# Altium schematic sheet Connectors.SchDoc: =DocumentName
size A4; Organization: Queen's Formula SAE; Address1: 130 Stuart St, Kingston; Address2: Ontario; Address3: Canada; Address4: K7L 2V9; DocumentNumber: 1; Revision: 0; SheetNumber: 1; SheetTotal: 1
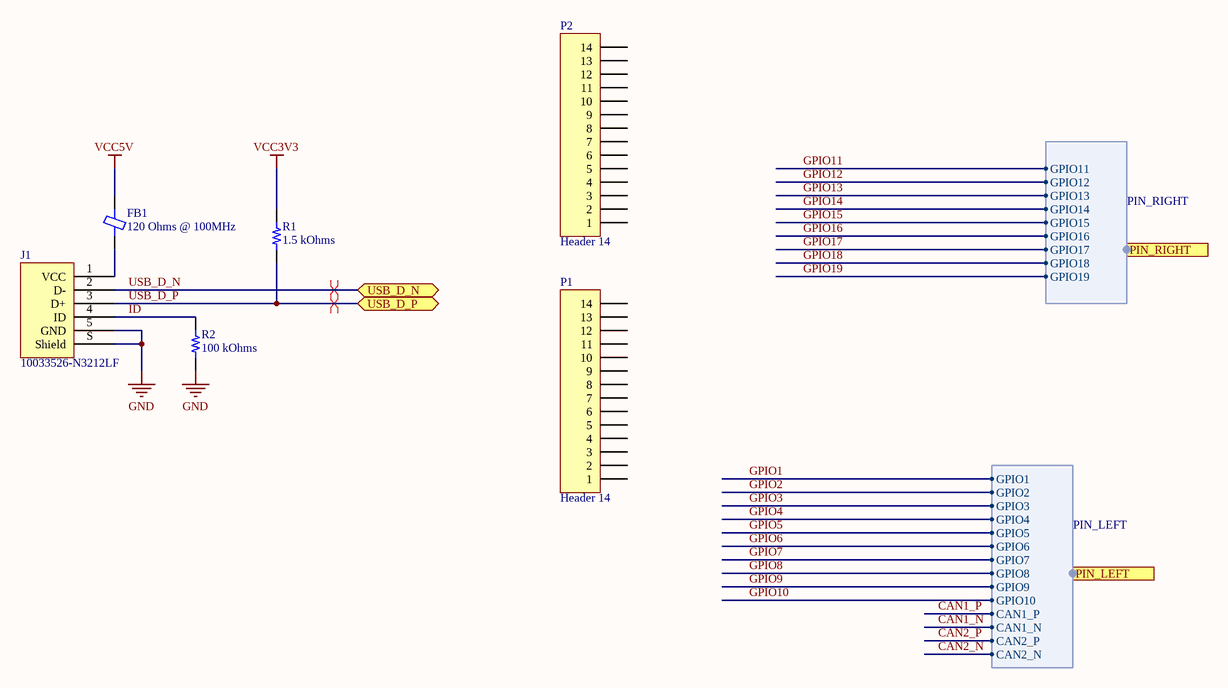
[diagram p0: Connectors.SchDoc]

## Parts
FB1  120 Ohms @ 100MHz  [FER 0805_2012]
J1  10033526-N3212LF  [FCI USB 10033526-N3212LF]
P1  Header 14  [HDR1X14]
P2  Header 14  [HDR1X14]
R1  1.5 kOhms  [RES 0402_1005]
R2  100 kOhms  [RES 0402_1005]

## Ports
PIN_LEFT (harness PIN_LEFT), PIN_RIGHT (harness PIN_RIGHT), USB_D_N (bidir), USB_D_P (bidir)

## Harnesses
PIN_LEFT: GPIO1, GPIO2, GPIO3, GPIO4, GPIO5, GPIO6, GPIO7, GPIO8, GPIO9, GPIO10, CAN1_P, CAN1_N, CAN2_P, CAN2_N
PIN_RIGHT: GPIO15, GPIO16, GPIO17, GPIO11, GPIO12, GPIO13, GPIO14, GPIO18, GPIO19

## Nets
GND: J1.5(GND) J1.S(Shield) R2.1
VCC3V3: R1.2
VCC5V: FB1.2
CAN1_N: port PIN_LEFT.CAN1_N
CAN1_P: port PIN_LEFT.CAN1_P
CAN2_N: port PIN_LEFT.CAN2_N
CAN2_P: port PIN_LEFT.CAN2_P
GPIO1: port PIN_LEFT.GPIO1
GPIO2: port PIN_LEFT.GPIO2
GPIO3: port PIN_LEFT.GPIO3
GPIO4: port PIN_LEFT.GPIO4
GPIO5: port PIN_LEFT.GPIO5
GPIO6: port PIN_LEFT.GPIO6
GPIO7: port PIN_LEFT.GPIO7
GPIO8: port PIN_LEFT.GPIO8
GPIO9: port PIN_LEFT.GPIO9
GPIO10: port PIN_LEFT.GPIO10
GPIO11: port PIN_RIGHT.GPIO11
GPIO12: port PIN_RIGHT.GPIO12
GPIO13: port PIN_RIGHT.GPIO13
GPIO14: port PIN_RIGHT.GPIO14
GPIO15: port PIN_RIGHT.GPIO15
GPIO16: port PIN_RIGHT.GPIO16
GPIO17: port PIN_RIGHT.GPIO17
GPIO18: port PIN_RIGHT.GPIO18
GPIO19: port PIN_RIGHT.GPIO19
ID: J1.4(ID) R2.2
USB_D_N: J1.2(D-) ; port USB_D_N
USB_D_P: J1.3(D+) R1.1 ; port USB_D_P
NetFB1_1: FB1.1 J1.1(VCC)

Not connected (* = marked no-connect by the designer): P1 1 2 3 4 5 6 7 8 9 10 11 12 13 14; P2 1 2 3 4 5 6 7 8 9 10 11 12 13 14

## Layout directives
differential pair: USB_D_N, USB_D_P

## Notes on the sheet
- Title
- Size:
- Date:
- A4
- Number:
- Time:
- Revision:
- Sheet
- of
- File:

## Library data of the parts
FB1 = 742792023: FERRITE BEAD 120 OHM 0805 1LN; Manufacturer: Würth Elektronik; Current Rating (Max): 3A; DC Resistance (DCR) (Max): 30mOhm; Filter Type: Signal Line; Number of Lines: 1; Part Number: 742792023; ComponentLink1Description: Datasheet; ComponentLink1URL: https://katalog.we-online.de/pbs/datasheet/742792023.pdf; ComponentLink2Description: DigiKey Link; ComponentLink2URL: http://digikey.com/product-detail/en/w-rth-elektronik/742792023/732-1613-1-ND/1639557; Device Package: 0805 (2012 Metric); Height (Max): 0.043" (1.10mm); Impedance @ Frequency: 120 Ohms @ 100MHz; LastUpdated: 2020-09-02 1:18:22 AM; Lifecycle Status: Active; Minimum Order: 1; Mounting Type: Surface Mount; Operating Temperature: -55°C ~ 125°C; Package / Case: 0805 (2012 Metric); Packaging: TapeAndReel; PartId: 1352; Part Status: Active; Price: 0.14; Series: WE-CBF; Size / Dimension: 0.079" L x 0.047" W (2.00mm x 1.20mm); Supplier 1: DigiKey; Supplier Part Number 1: 732-1613-1-ND; Value: 120 Ohms @ 100MHz
J1 = 10033526-N3212LF: CONN RCPT MINI USB B 5POS SMD RA; Manufacturer: Amphenol ICC (FCI); Connector Type: USB - mini B; Current Rating (Amps): 1A per Contact; Gender: Receptacle; Mating Cycles: 5000; Number of Contacts: 5; Number of Ports: 1; Shielding: Shielded; Voltage - Rated: 30V; Part Number: 10033526-N3212LF; ComponentLink1Description: Datasheet; ComponentLink1URL: http://www.amphenol-icc.com/media/wysiwyg/files/drawing/10033526.pdf; ComponentLink2Description: DigiKey Link; ComponentLink2URL: //digikey.com/product-detail/en/amphenol-icc-fci/10033526-N3212LF/609-4700-2-ND/4292074; Features: Board Guide, Solder Retention; LastUpdated: 2019-12-09 8:52:14 PM; Lifecycle Status: 0; Minimum Order: 1; Mounting Feature: Horizontal; Mounting Type: Surface Mount, Right Angle; Operating Temperature: -25°C ~ 85°C; Packaging: TapeAndReel; Part Status: Active; Price: 0.39; Series: -; Supplier 1: DigiKey; Supplier Part Number 1: 609-4700-2-ND; Termination: Solder
P1 P2 = Header 14: Header, 14-Pin; LatestRevisionDate: 17-Jul-2002; LatestRevisionNote: Re-released for DXP Platform.; Publisher: Altium Limited
R1 = RR0510P-152-D: RES SMD 1.5K OHM 0.5% 1/16W 0402; Manufacturer: Susumu; Power (Watts): 0.063W, 1/16W; Temperature Coefficient: ±25ppm/°C; Part Number: RR0510P-152-D; Value: 1.5 kOhms; ComponentLink1Description: Datasheet; ComponentLink1URL: http://www.susumu.co.jp/common/pdf/n_catalog_partition05_en.pdf; ComponentLink2Description: DigiKey Link; ComponentLink2URL: http://digikey.com/product-detail/en/susumu/RR0510P-152-D/RR05P1.5KDCT-ND/432940; Composition: Thin Film; Device Package: 0402 (1005 Metric); Height - Seated (Max): 0.016" (0.40mm); LastUpdated: 2020-09-02 1:08:09 AM; Lifecycle Status: Active; Minimum Order: 1; Number of Terminations: 2; Operating Temperature: -55°C ~ 125°C; Package / Case: 0402 (1005 Metric); Packaging: TapeAndReel; PartId: 3211; Part Status: Active; Price: 0.01; Resistance: 1.5 kOhms; Series: RR; Size / Dimension: 0.039" L x 0.020" W (1.00mm x 0.50mm); Supplier 1: DigiKey; Supplier Part Number 1: RR05P1.5KDCT-ND; Tolerance: ±0.5%
R2 = RP73PF1E100KBTD: RES 100K OHM 0.1% 1/10W 0402; Manufacturer: TE Connectivity Passive Product; Power (Watts): 0.1W, 1/10W; Temperature Coefficient: ±25ppm/°C; Part Number: RP73PF1E100KBTD; Value: 100 kOhms; ComponentLink1Description: Datasheet; ComponentLink1URL: https://www.te.com/commerce/DocumentDelivery/DDEController?Action=srchrtrv&DocNm=1773272&DocType=DS&DocLang=English; ComponentLink2Description: DigiKey Link; ComponentLink2URL: http://digikey.com/product-detail/en/te-connectivity-passive-product/RP73PF1E100KBTD/A127511CT-ND/8261477; Composition: Thin Film; Device Package: 0402 (1005 Metric); Height - Seated (Max): 0.014" (0.35mm); LastUpdated: 2020-09-02 1:08:10 AM; Lifecycle Status: Active; Minimum Order: 1; Number of Terminations: 2; Operating Temperature: -55°C ~ 155°C; Package / Case: 0402 (1005 Metric); Packaging: TapeAndReel; PartId: 2436; Part Status: Active; Price: 0.08; Resistance: 100 kOhms; Series: RP73P, Holsworthy; Size / Dimension: 0.039" L x 0.020" W (1.00mm x 0.50mm); Supplier 1: DigiKey; Supplier Part Number 1: A127511CT-ND; Supplier Device Package: 0402; Tolerance: ±0.1%